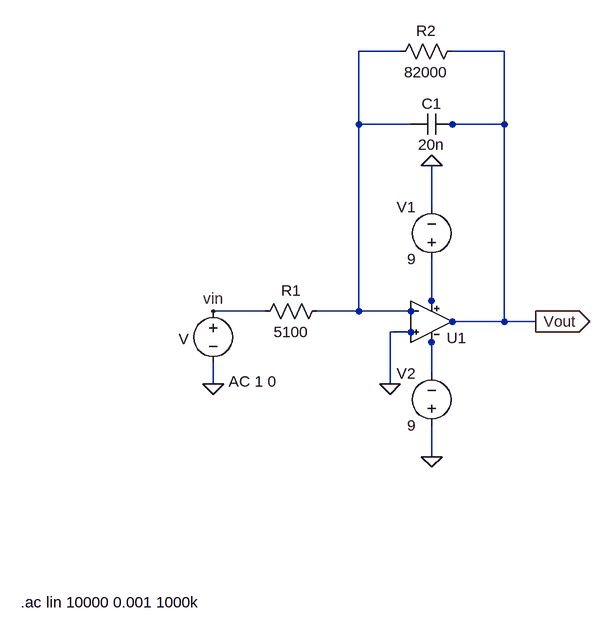
[diagram p0: schematic opamp - integrador.asc]
opamp - integrador.asc, the LTspice schematic file:
Version 4
SHEET 1 880 680
WIRE 272 -256 208 -256
WIRE 432 -256 352 -256
WIRE 208 -144 208 -256
WIRE 288 -144 208 -144
WIRE 352 -144 336 -144
WIRE 432 -144 432 -256
WIRE 432 -144 352 -144
WIRE 320 -16 320 -80
WIRE 320 128 320 64
WIRE 64 144 -16 144
WIRE 208 144 208 -144
WIRE 208 144 144 144
WIRE 288 144 208 144
WIRE 432 160 432 -144
WIRE 432 160 352 160
WIRE 480 160 432 160
WIRE 288 176 256 176
WIRE 320 240 320 192
WIRE -16 256 -16 224
WIRE 256 256 256 176
WIRE 320 368 320 320
FLAG -16 256 0
FLAG 256 256 0
FLAG 480 160 Vout
IOPIN 480 160 Out
FLAG -16 144 vin
FLAG 320 368 0
FLAG 320 -80 0
SYMBOL voltage -16 128 R0
WINDOW 0 -53 59 Left 2
WINDOW 123 24 124 Left 2
WINDOW 39 0 0 Left 2
WINDOW 3 24 152 Left 2
SYMATTR InstName V
SYMATTR Value2 AC 1 0
SYMATTR Value ""
SYMBOL voltage 320 80 R180
WINDOW 0 24 96 Left 2
WINDOW 3 24 16 Left 2
WINDOW 123 0 0 Left 2
WINDOW 39 0 0 Left 2
SYMATTR InstName V1
SYMATTR Value 9
SYMBOL voltage 320 336 R180
WINDOW 0 24 96 Left 2
WINDOW 3 24 16 Left 2
WINDOW 123 0 0 Left 2
WINDOW 39 0 0 Left 2
SYMATTR InstName V2
SYMATTR Value 9
SYMBOL res 160 128 R90
WINDOW 0 0 56 VBottom 2
WINDOW 3 32 56 VTop 2
SYMATTR InstName R1
SYMATTR Value 5100
SYMBOL cap 352 -160 R90
WINDOW 0 0 32 VBottom 2
WINDOW 3 32 32 VTop 2
SYMATTR InstName C1
SYMATTR Value 20n
SYMBOL nico\\LM833 320 160 R0
SYMATTR InstName U1
SYMBOL res 368 -272 R90
WINDOW 0 0 56 VBottom 2
WINDOW 3 32 56 VTop 2
SYMATTR InstName R2
SYMATTR Value 82000
TEXT -312 592 Left 2 !.ac lin 10000 0.001 1000k

The netlist it stands for:
* opamp - integrador.asc
V vin 0 AC 1 0
V1 N002 0 9
V2 0 N003 9
R1 N001 vin 5100
C1 Vout N001 20n
XU1 0 0 N001 N001 N002 N002 N003 N003 Vout Vout LM833 LM833 Avol=316.2K GBW=15Meg Slew=5Meg ilimit=25m rail=0 Vos=0 phimargin=60 en=0 enk=0 in=0 ink=0 Rin=175K  ; pins In+ In+ In- In- V+ V+ V- V- OUT OUT
R2 Vout N001 82000
.ac lin 10000 0.001 1000k
.lib nico/LM833.sub
.backanno
.end